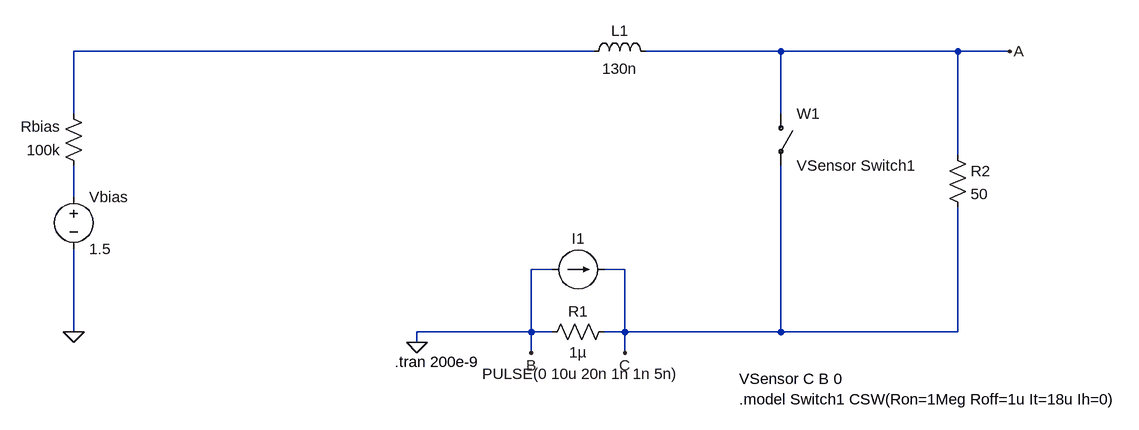
[diagram p0: schematic curve-fit-model.asc]
curve-fit-model.asc, the LTspice schematic file:
Version 4
SHEET 1 1216 680
WIRE 336 -224 -464 -224
WIRE 624 -224 416 -224
WIRE 896 -224 624 -224
WIRE 976 -224 896 -224
WIRE -464 -128 -464 -224
WIRE 624 -128 624 -224
WIRE 896 -64 896 -224
WIRE -464 0 -464 -48
WIRE 272 112 240 112
WIRE 384 112 352 112
WIRE -464 208 -464 80
WIRE 240 208 240 112
WIRE 240 208 64 208
WIRE 272 208 240 208
WIRE 384 208 384 112
WIRE 384 208 352 208
WIRE 624 208 624 -48
WIRE 624 208 384 208
WIRE 896 208 896 16
WIRE 896 208 624 208
WIRE 64 224 64 208
WIRE 240 240 240 208
WIRE 384 240 384 208
FLAG 64 224 0
FLAG 976 -224 A
FLAG 240 240 B
FLAG 384 240 C
FLAG -464 208 0
SYMBOL ind 320 -208 R270
WINDOW 0 32 56 VTop 2
WINDOW 3 5 56 VBottom 2
SYMATTR InstName L1
SYMATTR Value 130n
SYMBOL current 272 112 R270
WINDOW 0 32 40 VTop 2
WINDOW 3 -176 44 VTop 2
WINDOW 123 0 0 Left 0
WINDOW 39 0 0 Left 0
SYMATTR InstName I1
SYMATTR Value PULSE(0 10u 20n 1n 1n 5n)
SYMBOL res 880 -80 R0
SYMATTR InstName R2
SYMATTR Value 50
SYMBOL csw 624 -128 R0
SYMATTR InstName W1
SYMATTR Value VSensor Switch1
SYMBOL voltage -464 -16 R0
WINDOW 123 0 0 Left 0
WINDOW 39 0 0 Left 0
SYMATTR InstName Vbias
SYMATTR Value 1.5
SYMBOL res -448 -32 R180
WINDOW 0 36 76 Left 2
WINDOW 3 36 40 Left 2
SYMATTR InstName Rbias
SYMATTR Value 100k
SYMBOL res 368 192 R90
WINDOW 0 0 56 VBottom 2
WINDOW 3 32 56 VTop 2
SYMATTR InstName R1
SYMATTR Value 1µ
TEXT 30 254 Left 2 !.tran 200e-9
TEXT 560 280 Left 2 !VSensor C B 0
TEXT 560 312 Left 2 !.model Switch1 CSW(Ron=1Meg Roff=1u It=18u Ih=0)

The netlist it stands for:
* curve-fit-model.asc
L1 N001 A 130n
I1 0 C PULSE(0 10u 20n 1n 1n 5n)
R2 A C 50
W1 A C VSensor Switch1
Vbias N002 0 1.5
Rbias N002 N001 100k
R1 C 0 1µ
.tran 200e-9
VSensor C B 0
.model Switch1 CSW(Ron=1Meg Roff=1u It=18u Ih=0)
.backanno
.end